# Altium schematic sheet CanNode.SchDoc
size A4
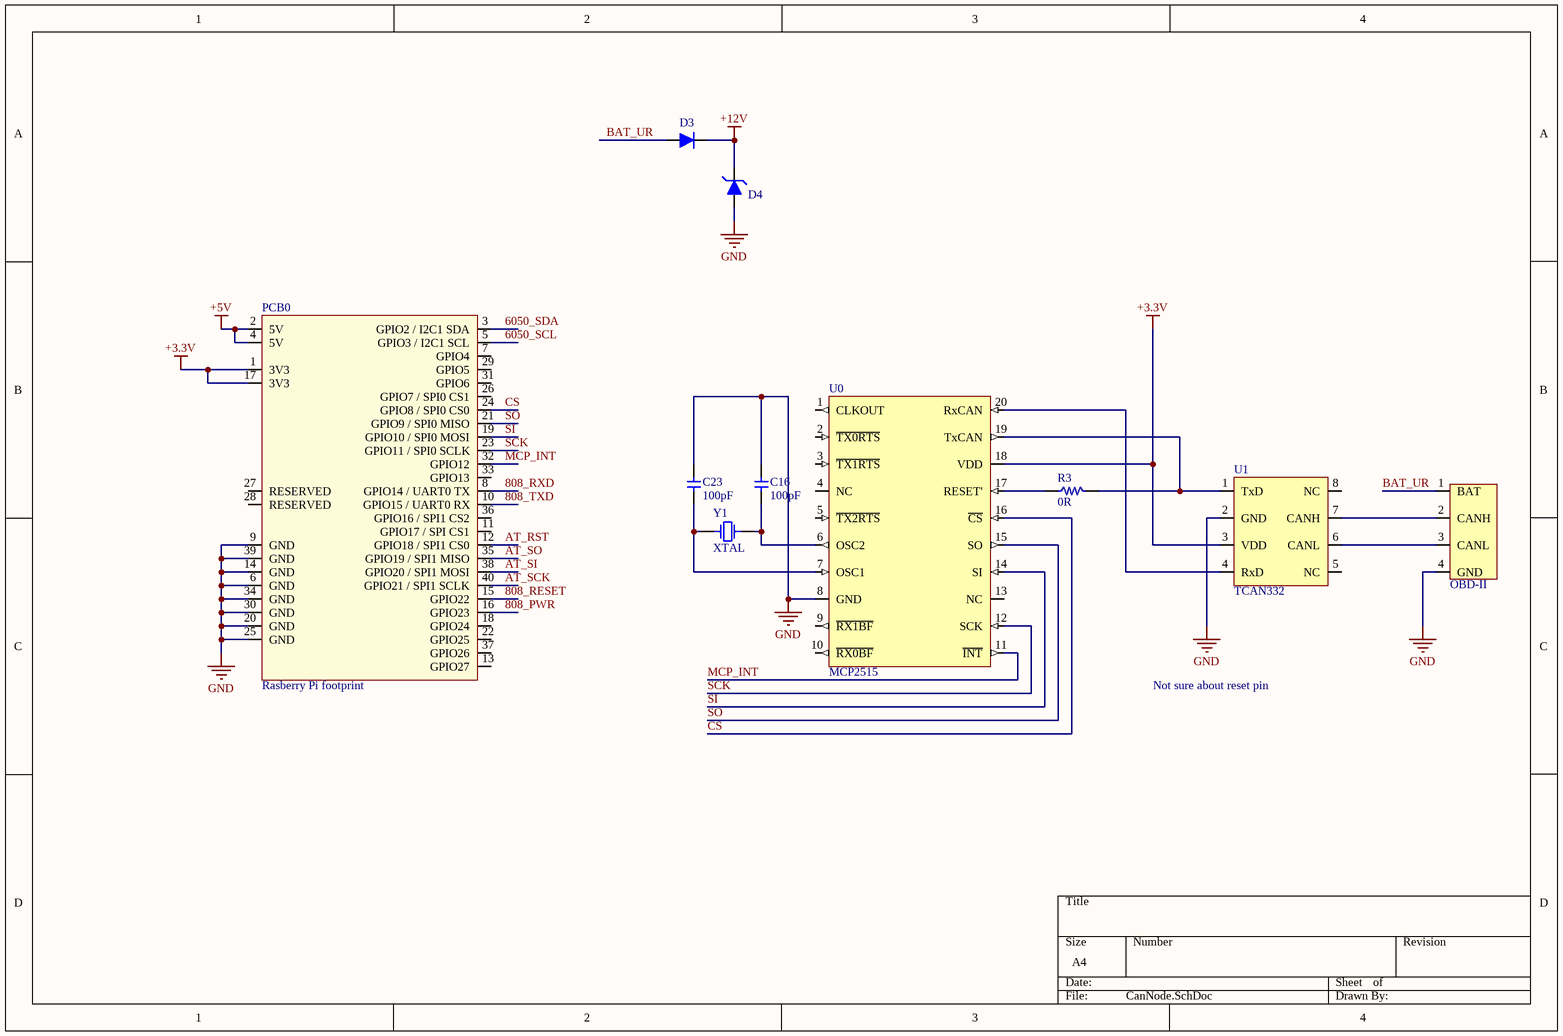
[diagram p0: CanNode.SchDoc]

## Parts
C16  value 100pF  [0805]  (hidden comment: Generic Capacitor)
C23  value 100pF  [0805]  (hidden comment: Generic Capacitor)
D3  RSX301L-30TE25  [SMA_diode]  (value not drawn)
D4  TVS Diode  [TVS Diode 15]  (value not drawn)
OBD-II  OBD-II  [OBD_II]  (value not drawn)
PCB0  Rasberry Pi footprint  [Rasberry PI]
R3  value 0R  [0805]  (hidden comment: Resistor)
U0  MCP2515  Notes: Not sure about reset pin  [MCP2515]
U1  TCAN332  [SOIC-8]
Y1  XTAL  [XTAL-16.000]

## Nets
+3.3V: PCB0.1(3V3) PCB0.17(3V3) U0.18(VDD) U1.3(VDD)
+5V: PCB0.2(5V) PCB0.4(5V)
+12V: D3.2 D4.2
GND: C16.2 C23.2 D4.1 OBD-II.4(GND) PCB0.6(GND) PCB0.9(GND) PCB0.14(GND) PCB0.20(GND) PCB0.25(GND) PCB0.30(GND) PCB0.34(GND) PCB0.39(GND) U0.8(GND) U1.2(GND)
808_PWR: PCB0.16(GPIO23)
808_RESET: PCB0.15(GPIO22)
808_RXD: PCB0.8(GPIO14_/_UART0_TX)
808_TXD: PCB0.10(GPIO15_/_UART0_RX)
6050_SCL: PCB0.5(GPIO3_/_I2C1_SCL)
6050_SDA: PCB0.3(GPIO2_/_I2C1_SDA)
AT_RST: PCB0.12(GPIO18_/_SPI1_CS0)
AT_SCK: PCB0.40(GPIO21_/_SPI1_SCLK)
AT_SI: PCB0.38(GPIO20_/_SPI1_MOSI)
AT_SO: PCB0.35(GPIO19_/_SPI1_MISO)
BAT_UR: D3.1 OBD-II.1(BAT)
CS: PCB0.24(GPIO8_/_SPI0_CS0) U0.16(~{CS})
MCP_INT: PCB0.32(GPIO12) U0.11(~{INT})
SCK: PCB0.23(GPIO11_/_SPI0_SCLK) U0.12(SCK)
SI: PCB0.19(GPIO10_/_SPI0_MOSI) U0.14(SI)
SO: PCB0.21(GPIO9_/_SPI0_MISO) U0.15(SO)
NetC16_1: C16.1 U0.6(OSC2) Y1.1
NetC23_1: C23.1 U0.7(OSC1) Y1.0
NetOBD-II_2: OBD-II.2(CANH) U1.7(CANH)
NetOBD-II_3: OBD-II.3(CANL) U1.6(CANL)
NetR3_1: R3.1 U0.17(RESET')
NetR3_2: R3.2 U0.19(TxCAN) U1.1(TxD)
NetU0_20: U0.20(RxCAN) U1.4(RxD)

Not connected (* = marked no-connect by the designer): PCB0 7(GPIO4) 11(GPIO17_/_SPI_CS1) 13(GPIO27) 18(GPIO24) 22(GPIO25) 26(GPIO7_/_SPI0_CS1) 27(RESERVED) 28(RESERVED) 29(GPIO5) 31(GPIO6) 33(GPIO13) 36(GPIO16_/_SPI1_CS2) 37(GPIO26); U0 1(CLKOUT) 2(~{TX0RTS}) 3(~{TX1RTS}) 4(NC) 5(~{TX2RTS}) 9(~{RX1BF}) 10(~{RX0BF}) 13(NC); U1 5(NC) 8(NC)

## Library data of the parts
C16 C23 = Capacitor
D3 = RSX301L-30TE25: DIODE SCHOTTKY 30V 3A; Supplier: DigiKey; Supplier PN: RSX301L-30TE25CT-ND
D4 = SMBJ15D-M3/H: TVS DIODE 15VWM 24VC DO214AA; Manufacturer: Vishay Semiconductor Diodes Division; Type: Zener; Unidirectional Channels: 1; Voltage - Reverse Standoff (Typ): 15V; Voltage - Breakdown (Min): 17V; Voltage - Clamping (Max) @ Ipp: 24V; Current - Peak Pulse (10/1000µs): 25A; Power - Peak Pulse: 600W; Power Line Protection: No; Supplier 1: Digi-Key; Manufacturer Part Number: SMBJ15D-M3/H; Pricing 1: 1=0.51, 10=0.42, 25=0.3832, 100=0.2853, 250=0.25852 (CAD); Packaging: Cut Tape (CT); Part Status: Active; Bidirectional Channels: -; Applications: General Purpose; Capacitance @ Frequency: -; Operating Temperature: -55°C ~ 150°C (TJ); Mounting Type: Surface Mount; Package / Case: DO-214AA, SMB; Supplier Device Package: DO-214AA (SMBJ); ComponentLink1URL: http://www.vishay.com/docs/87606/87606.pdf; ComponentLink1Description: http://www.vishay.com/docs/87606/87606.pdf; Supplier Part Number 1: SMBJ15D-M3/HGICT-ND
PCB0 = Rasberry Pi
R3 = Resistor: Generic Resistor
U0 = MCP2515: IC CAN CTLR W/SPI 2.0B 20-QFN; Mfr 1: Microchip Technology; Digi-Key Part Number: MCP2515T-I/MLCT-ND
U1 = TCAN332: IC TXRX CAN 8SOIC; Mfr 1: Texas Instruments; Digi-Key Part Number: 296-43711-1-ND
Y1 = XTAL-16.000: XTAL16.0000MHZ 18PF SMD; Manufacturer: Abracon LLC; Manufacturer Part Number: ABM7-16.000MHZ-D2Y-T; Frequency: 16MHz; Frequency Stability: ±30ppm; Frequency Tolerance: ±20ppm; ESR (Equivalent Series Resistance): 50 Ohm; Operating Mode: Fundamental; Supplier 1: Digi-Key; Pricing 1: 1=1.12, 10=0.989, 50=0.9234, 100=0.8162, 500=0.77322 (CAD); Packaging: Cut Tape (CT); Part Status: Active; Type: MHz Crystal; Load Capacitance: 18pF; Operating Temperature: -40°C ~ 85°C; Ratings: -; Mounting Type: Surface Mount; Package / Case: 2-SMD, No Lead; Size / Dimension: 0.236" L x 0.138" W (6.00mm x 3.50mm); Height - Seated (Max): 0.055" (1.40mm); ComponentLink1URL: http://www.abracon.com/Resonators/abm7.pdf; ComponentLink1Description: http://www.abracon.com/Resonators/abm7.pdf; Supplier Part Number 1: 535-9840-1-ND